# Altium schematic sheet Mainboard.SchDoc
size A4; SheetNumber: 2; SheetTotal: 2
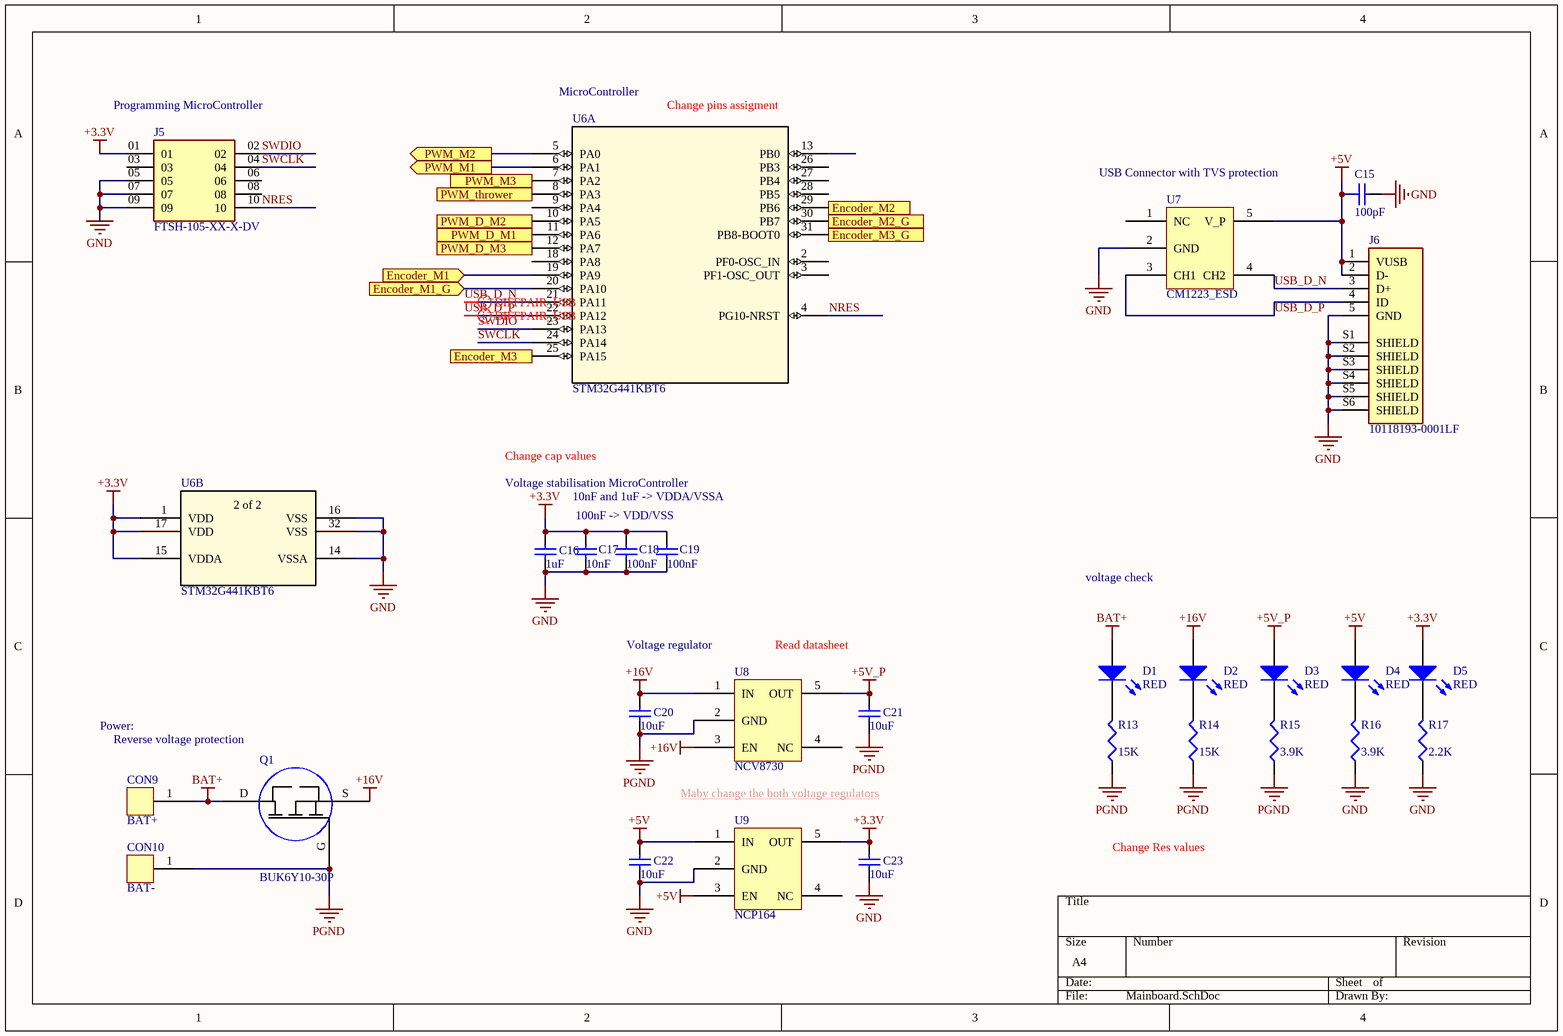
[diagram p0: Mainboard.SchDoc]

## Parts
C15  value 100pF  [1608[0603]]  (hidden comment: Cap Semi)
C16  value 1uF  [1608[0603]]  (hidden comment: Cap Semi)
C17  value 10nF  [1608[0603]]  (hidden comment: Cap Semi)
C18  value 100nF  [1608[0603]]  (hidden comment: Cap Semi)
C19  value 100nF  [1608[0603]]  (hidden comment: Cap Semi)
C20  value 10uF  [C1210]  (hidden comment: Cap Semi)
C21  value 10uF  [C1210]  (hidden comment: Cap Semi)
C22  value 10uF  [C1210]  (hidden comment: Cap Semi)
C23  value 10uF  [C1210]  (hidden comment: Cap Semi)
CON9  BAT+  [con_soldering]
CON10  BAT-  [con_soldering]
D1  RED  [3.2X1.6X1.1]
D2  RED  [3.2X1.6X1.1]
D3  RED  [3.2X1.6X1.1]
D4  RED  [3.2X1.6X1.1]
D5  RED  [3.2X1.6X1.1]
J5  FTSH-105-XX-X-DV  [SAMTEC_FTSH-105-XX-X-DV]
J6  10118193-0001LF  [FCI_10118193-0001LF]
Q1  BUK6Y10-30P  [TRANS_PSMN5R5-60YS,115]
R13  value 15K  [J1-0603]  (hidden comment: Res3)
R14  value 15K  [J1-0603]  (hidden comment: Res3)
R15  value 3.9K  [J1-0603]  (hidden comment: Res3)
R16  value 3.9K  [J1-0603]  (hidden comment: Res3)
R17  value 2.2K  [J1-0603]  (hidden comment: Res3)
U6  STM32G441KBT6  [LQFP-32]  (parts A,B of 2)
U7  CM1223_ESD  [CM1223_ESD]
U8  NCV8730  [NCP164CSN330T1G_Voltage_regulator]
U9  NCP164  [NCP164CSN330T1G_Voltage_regulator]

## Ports
Encoder_M1 (in), Encoder_M1_G (in), Encoder_M2 (in), Encoder_M2_G (in), Encoder_M3 (in), Encoder_M3_G (in), PWM_D_M1 (out), PWM_D_M2 (out), PWM_D_M3 (out), PWM_M1 (out), PWM_M2 (out), PWM_M3 (out), PWM_thrower (out)

## Nets
+3.3V: C16.2 C17.2 C18.2 C19.2 C23.2 D5.1(A) J5.01 U6.1(VDD) U6.15(VDDA) U6.17(VDD) U9.5(OUT)
+5V: C15.2 C22.2 D4.1(A) J6.1(VUSB) J6.2(D-) U7.5(V_P) U9.1(IN) U9.3(EN)
+5V_P: C21.2 D3.1(A) U8.5(OUT)
+16V: C20.2 D2.1(A) Q1.S U8.1(IN) U8.3(EN)
BAT+: CON9.1 D1.1(A) Q1.D
GND: C15.1 C16.1 C17.1 C18.1 C19.1 C22.1 C23.1 J5.05 J5.07 J5.09 J6.5(GND) J6.S1(SHIELD) J6.S2(SHIELD) J6.S3(SHIELD) J6.S4(SHIELD) J6.S5(SHIELD) J6.S6(SHIELD) R16.1 R17.1 U6.14(VSSA) U6.16(VSS) U6.32(VSS) U7.2(GND) U9.2(GND)
PGND: C20.1 C21.1 CON10.1 Q1.G R13.1 R14.1 R15.1 U8.2(GND)
Encoder_M1: U6.19(PA9) ; port Encoder_M1
Encoder_M1_G: U6.20(PA10) ; port Encoder_M1_G
Encoder_M2: U6.29(PB6) ; port Encoder_M2
Encoder_M2_G: U6.30(PB7) ; port Encoder_M2_G
Encoder_M3: U6.25(PA15) ; port Encoder_M3
Encoder_M3_G: U6.31(PB8-BOOT0) ; port Encoder_M3_G
NRES: J5.10 U6.4(PG10-NRST)
PWM_D_M1: U6.11(PA6) ; port PWM_D_M1
PWM_D_M2: U6.10(PA5) ; port PWM_D_M2
PWM_D_M3: U6.12(PA7) ; port PWM_D_M3
PWM_M1: U6.6(PA1) ; port PWM_M1
PWM_M2: U6.5(PA0) ; port PWM_M2
PWM_M3: U6.7(PA2) ; port PWM_M3
PWM_thrower: U6.8(PA3) ; port PWM_thrower
SWCLK: J5.04 U6.24(PA14)
SWDIO: J5.02 U6.23(PA13)
USB_D_N: J6.3(D+) U6.21(PA11) U7.4(CH2)
USB_D_P: J6.4(ID) U6.22(PA12) U7.3(CH1)
NetD1_2: D1.2(K) R13.2
NetD2_2: D2.2(K) R14.2
NetD3_2: D3.2(K) R15.2
NetD4_2: D4.2(K) R16.2
NetD5_2: D5.2(K) R17.2

Not connected (* = marked no-connect by the designer): J5 03 06 08; U6 2(PF0-OSC_IN) 3(PF1-OSC_OUT) 9(PA4) 13(PB0) 18(PA8) 26(PB3) 27(PB4) 28(PB5); U7 1(NC); U8 4(NC); U9 4(NC)

## Layout directives
differential pair; differential pair class diff_USB: USB_D_N, USB_D_P

## Notes on the sheet
- (near J5) Programming MicroController
- MicroController
- (near U6) Change pins assigment
- USB Connector with TVS protection
- Voltage stabilisation MicroController
- Change cap values
- 10nF and 1uF -> VDDA/VSSA
- 100nF -> VDD/VSS
- voltage check
- Voltage regulator
- Read datasheet
- Power:
- Reverse voltage protection
- Maby change the both voltage regulators
- Change Res values
- (in symbol STM32G441KBT6, part B) 2 of 2

## Library data of the parts
C15-C23 = Cap Semi: Capacitor (Semiconductor SIM Model); Published: 8-Jun-2000; LatestRevisionDate: 29-May-2009; LatestRevisionNote: IPC-7351 Footprint Added.; PackageReference: C1206; Publisher: Altium Limited; PackageDescription: Chip Capacitor
CON9 CON10 = Con_soldering
D1-D5 = LED2: Typical RED, GREEN, YELLOW, AMBER GaAs LED; Published: 8-Jun-2000; LatestRevisionDate: 17-Jul-2002; LatestRevisionNote: Re-released for DXP Platform.; PackageVersion: Feb-2002; PackageReference: 3.2X1.6X1.1; Publisher: Altium Limited; PackageDescription: SM LED; 2 Flat Leads
J5 = FTSH-105-XX-X-DV: Connector Header Surface Mount 10 position 0.050" (1.27mm); Availability: Unavailable; Package: None; MP: FTSH-105-XX-X-DV; Price: None; Value: *
J6 = 10118193-0001LF: USB - micro B USB 2.0 Receptacle Connector 5 Position Surface Mount, Right Angle; Through Hole; MF: Amphenol ICC; Availability: Unavailable; SnapEDA_Link: https://www.snapeda.com/parts/10118193-0001LF/Amphenol%20FCI/view-part/2758989/?ref=snap; MP: 10118193-0001LF; Price: None; Value: *; Package: None
R13-R17 = Res3: Resistor; Published: 8-Jun-2000; LatestRevisionDate: 29-May-2009; LatestRevisionNote: IPC-7351 Footprint Added.; PackageReference: J1-0603; Publisher: Altium Limited; PackageDescription: Chip Resistor
U6 = STM32G441KBT6: No Description Available; Mfr_Name: STMicroelectronics; Copyright: Copyright (C) 2021 Ultra Librarian. All rights reserved.; Manufacturer_Part_Number: STM32G441KBT6; Digi-Key_Part_Number_1: STM32G441KBT6-ND; RefDes: RefDes; Type: DEV